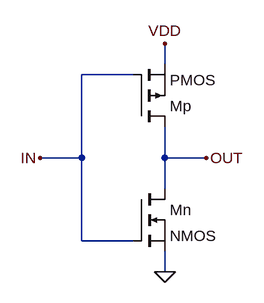
[diagram p0: schematic Circuit.asc]
Circuit.asc, the LTspice schematic file:
Version 4
SHEET 1 880 680
WIRE 208 0 208 -32
WIRE 160 16 80 16
WIRE 80 144 80 16
WIRE 80 144 16 144
WIRE 208 144 208 96
WIRE 272 144 208 144
WIRE 208 192 208 144
WIRE 80 272 80 144
WIRE 160 272 80 272
WIRE 208 320 208 288
FLAG 208 320 0
FLAG 208 -32 VDD
FLAG 16 144 IN
FLAG 272 144 OUT
SYMBOL nmos 160 192 R0
SYMATTR InstName Mn
SYMBOL pmos 160 96 M180
SYMATTR InstName Mp

The netlist it stands for:
* Circuit.asc
Mn OUT IN 0 0 NMOS
Mp OUT IN VDD VDD PMOS
.model NMOS NMOS
.model PMOS PMOS
.lib standard.mos
.backanno
.end